# EasyEDA schematic servo-flipper.json
TITLE: Sheet_1; REV: 1.0; Date: 2024-05-01; Sheet: 1/1; Company: Your Company
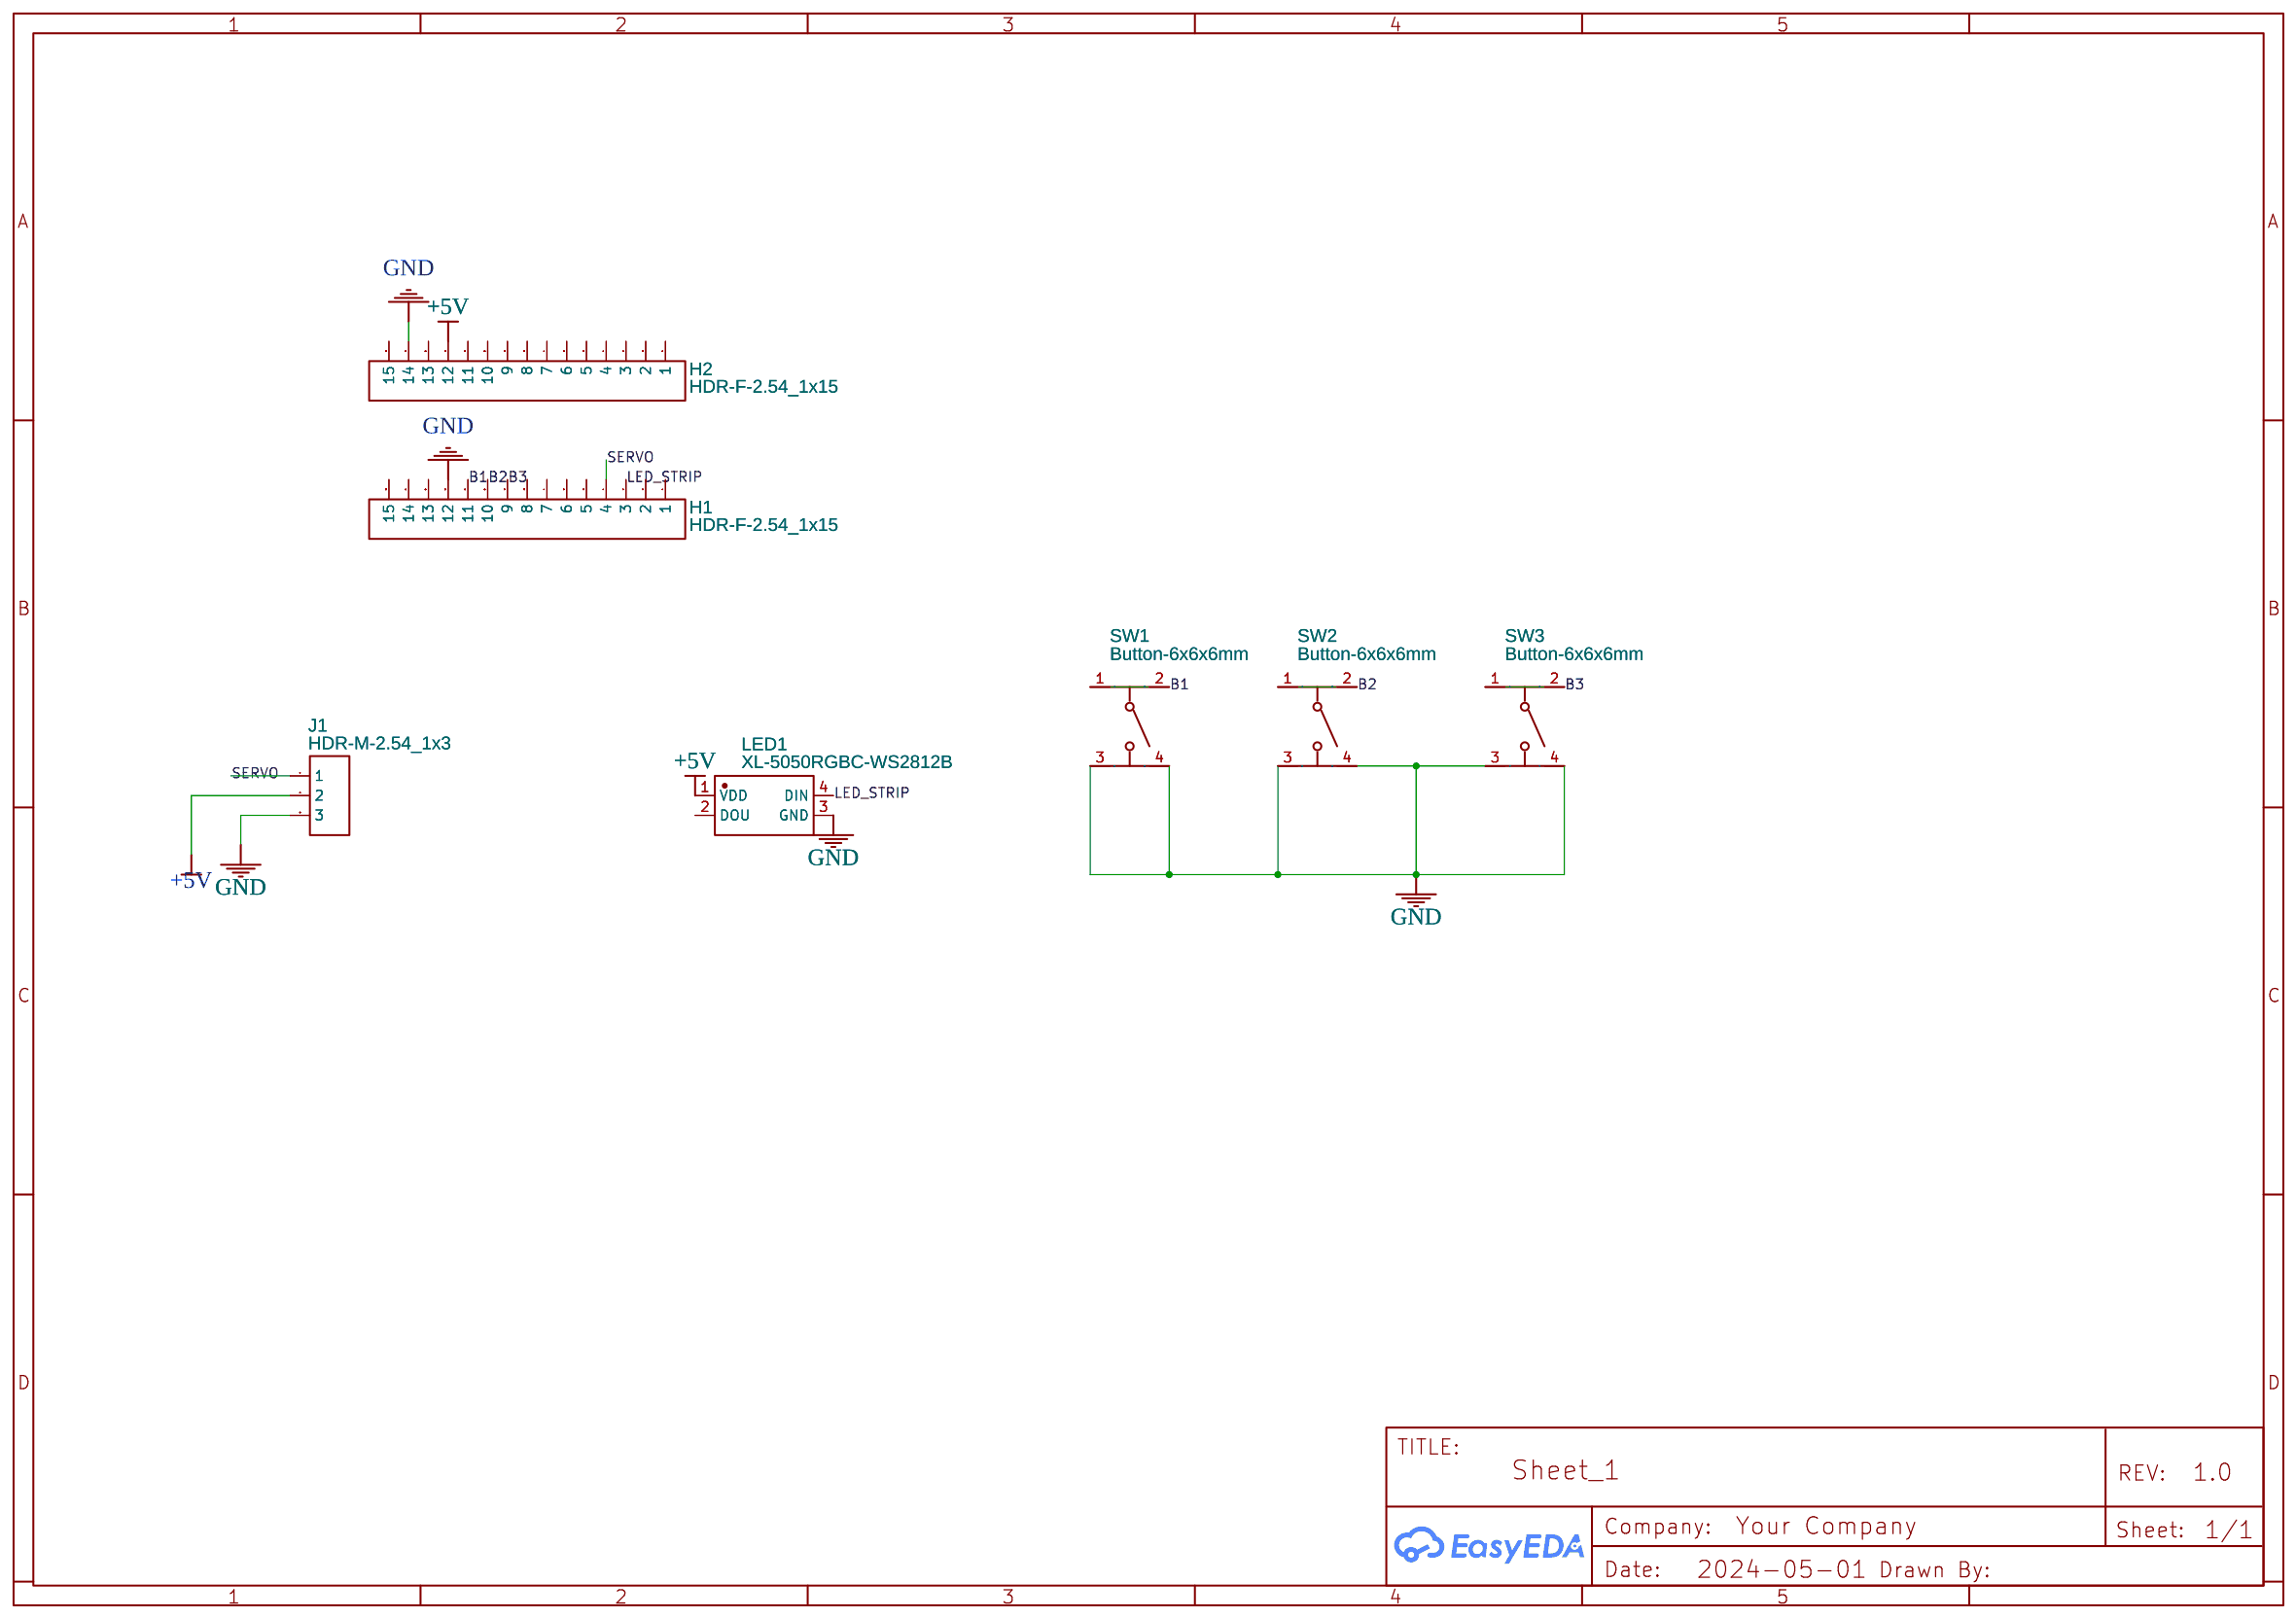
[diagram p0: schematic sheet]

## Parts
H1  HDR-F-2.54_1x15  [HDR-F-2.54_1X15]
H2  HDR-F-2.54_1x15  [HDR-F-2.54_1X15]
J1  HDR-M-2.54_1x3  [HDR-M-2.54_1X3]
LED1  XL-5050RGBC-WS2812B  [LED-SMD_4P-L5.0-W5.0-BL_XL-5050RGBC]
SW1  Button-6x6x6mm  [SW-TH_4P-L6.0-W6.0-P4.50-LS6.1]
SW2  Button-6x6x6mm  [SW-TH_4P-L6.0-W6.0-P4.50-LS6.1]
SW3  Button-6x6x6mm  [SW-TH_4P-L6.0-W6.0-P4.50-LS6.1]

## Library data of the parts
H1 H2 = HDR-F-2.54_1x15: Supplier Part: C124408; Supplier: LCSC; Contributor: LCEDA_Lib
J1 = HDR-M-2.54_1x3: Supplier Part: C180248; Supplier: LCSC; Contributor: LCEDA_Lib
LED1 = XL-5050RGBC-WS2812B: Contributor: LCSC; Supplier: LCSC; Supplier Part: C2843785; Manufacturer: XINGLIGHT(成兴光); JLCPCB Part Class: Extended Part
SW1-SW3 = Button-6x6x6mm: Supplier Part: C71836; Supplier: LCSC; Manufacturer: BBJ; Manufacturer Part: Switch,6*6*6Plastic head,260G, 0.25mm,Straight line

## Nets
+5V: H2.12 J1.2 LED1.1(VDD)
GND: H1.12 H2.14 J1.3 LED1.3(GND) SW1.3 SW1.4 SW2.3 SW2.4 SW3.3 SW3.4
B1: H1.11 SW1.1 SW1.2
B2: H1.10 SW2.1 SW2.2
B3: H1.9 SW3.1 SW3.2
LED_STRIP: H1.3 LED1.4(DIN)
SERVO: H1.4 J1.1

Not connected (* = marked no-connect by the designer): H1 1 2 5 6 7 8 13 14 15; H2 1 2 3 4 5 6 7 8 9 10 11 13 15; LED1 2(DOU)
